# EAGLE schematic bms 2 (EAGLE 9.6.2)
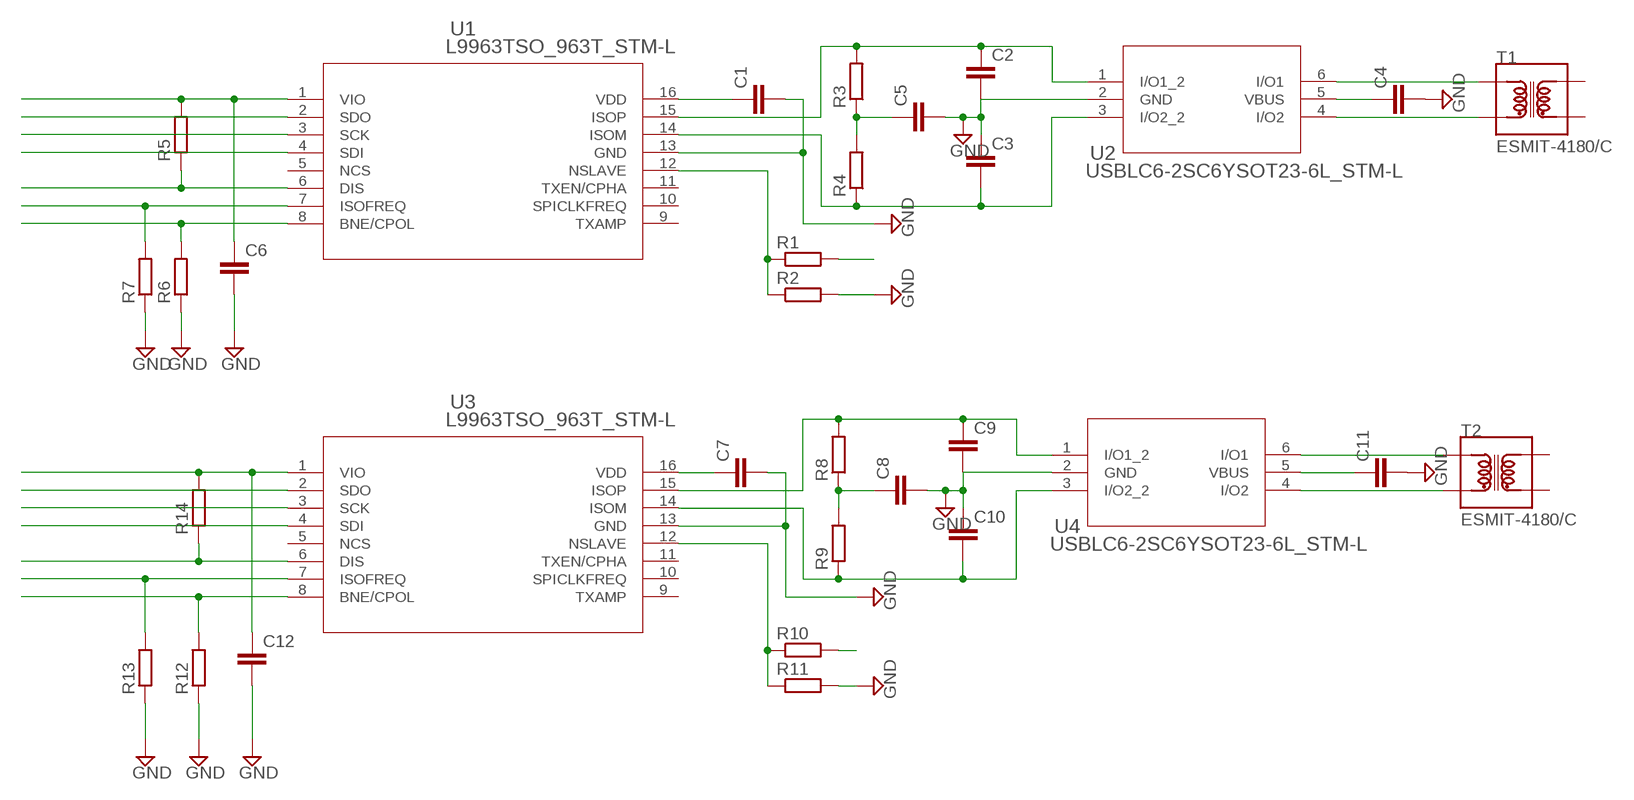
[diagram p0: schematic, sheet 1]

## Parts
C1  C-EUC0402  [C0402]
C2  C-EUC0402  [C0402]
C3  C-EUC0402  [C0402]
C4  C-EUC0402  [C0402]
C5  C-EUC0402  [C0402]
C6  C-EUC0402  [C0402]
C7  C-EUC0402  [C0402]
C8  C-EUC0402  [C0402]
C9  C-EUC0402  [C0402]
C10  C-EUC0402  [C0402]
C11  C-EUC0402  [C0402]
C12  C-EUC0402  [C0402]
R1  R-EU_M0805  [M0805]
R2  R-EU_M0805  [M0805]
R3  R-EU_M0805  [M0805]
R4  R-EU_M0805  [M0805]
R5  R-EU_M0805  [M0805]
R6  R-EU_M0805  [M0805]
R7  R-EU_M0805  [M0805]
R8  R-EU_M0805  [M0805]
R9  R-EU_M0805  [M0805]
R10  R-EU_M0805  [M0805]
R11  R-EU_M0805  [M0805]
R12  R-EU_M0805  [M0805]
R13  R-EU_M0805  [M0805]
R14  R-EU_M0805  [M0805]
T1  ESMIT-4180/C  [XFMR_ESMIT-4180/C]
T2  ESMIT-4180/C  [XFMR_ESMIT-4180/C]
U1  L9963TSO_963T_STM-L  [SO_963T_STM-L]
U2  USBLC6-2SC6YSOT23-6L_STM-L  [SOT23-6L_STM-L]
U3  L9963TSO_963T_STM-L  [SO_963T_STM-L]
U4  USBLC6-2SC6YSOT23-6L_STM-L  [SOT23-6L_STM-L]

## Nets
GND: C1.2 C2.2 C3.1 C4.2 C5.2 C6.2 C7.2 C8.2 C9.2 C10.1 C11.2 C12.2 R2.2 R6.1 R7.1 R11.2 R12.1 R13.1 U1.13(GND) U2.2(GND) U3.13(GND) U4.2(GND)
N$1: C2.1 R3.2 U1.15(ISOP) U2.1(I/O1_2)
N$2: C5.1 R3.1 R4.2
N$3: C3.2 R4.1 U1.14(ISOM) U2.3(I/O2_2)
N$4: C7.1 U3.16(VDD)
N$5: C1.1 U1.16(VDD)
N$7: R1.1 R2.1 U1.12(NSLAVE)
N$8: C9.1 R8.2 U3.15(ISOP) U4.1(I/O1_2)
N$9: C8.1 R8.1 R9.2
N$10: T1.2 U2.6(I/O1)
N$11: T1.1 U2.4(I/O2)
N$12: C4.1 U2.5(VBUS)
N$13: C6.1 R5.2 U1.1(VIO)
N$14: U1.2(SDO)
N$15: U1.3(SCK)
N$16: U1.4(SDI)
N$17: R5.1 U1.6(DIS)
N$18: R7.2 U1.7(ISOFREQ)
N$19: R6.2 U1.8(BNE/CPOL)
N$21: C10.2 R9.1 U3.14(ISOM) U4.3(I/O2_2)
N$22: C11.1 U4.5(VBUS)
N$23: T2.2 U4.6(I/O1)
N$24: T2.1 U4.4(I/O2)
N$26: R10.1 R11.1 U3.12(NSLAVE)
N$27: R10.2
N$29: C12.1 R14.2 U3.1(VIO)
N$30: U3.2(SDO)
N$31: U3.3(SCK)
N$32: U3.4(SDI)
N$33: R14.1 U3.6(DIS)
N$34: R13.2 U3.7(ISOFREQ)
N$35: R12.2 U3.8(BNE/CPOL)
N$39: R1.2
Unconnected: T1.3 T1.4 T2.3 T2.4 U1.5(NCS) U1.9(TXAMP) U1.10(SPICLKFREQ) U1.11(TXEN/CPHA) U3.5(NCS) U3.9(TXAMP) U3.10(SPICLKFREQ) U3.11(TXEN/CPHA)

## Library data of the parts
C1-C12 = rcl:C-EU: CAPACITOR, European symbol; SPICEPREFIX: C
R1-R14 = rcl:R-EU_: RESISTOR, European symbol; SPICEPREFIX: R
T1 T2 = ESMIT-4180_C:ESMIT-4180/C: Audio Transformer, 3750 Vrms Isolation, DC Resistance Primary-Secondary 250 mOhm, SMT Check prices <https://pricing.snapeda.com/parts/ESMIT-4180/C/Sumida%20America/view-part?ref=eda>; AVAILABILITY: In Stock; DESCRIPTION: - Impedance Primary Ohms - Impedance Secondary Ohms - Audio Transformer - Surface Mount; MF: Sumida America; MP: ESMIT-4180/C; PACKAGE: 0805 Sumida; PRICE: None; PURCHASE-URL: https://pricing.snapeda.com/search/part/ESMIT-4180/C/?ref=eda
U1 U3 = L9963:L9963T; COPYRIGHT: Copyright (C) 2021 Ultra Librarian. All rights reserved.; MANUFACTURER_PART_NUMBER: L9963T; MFR_NAME: STMicroelectronics
U2 U4 = USBLC6-2SC6Y:USBLC6-2SC6Y; COPYRIGHT: Copyright (C) 2021 Ultra Librarian. All rights reserved.; MANUFACTURER_PART_NUMBER: USBLC6-2SC6Y; MFR_NAME: STMicroelectronics